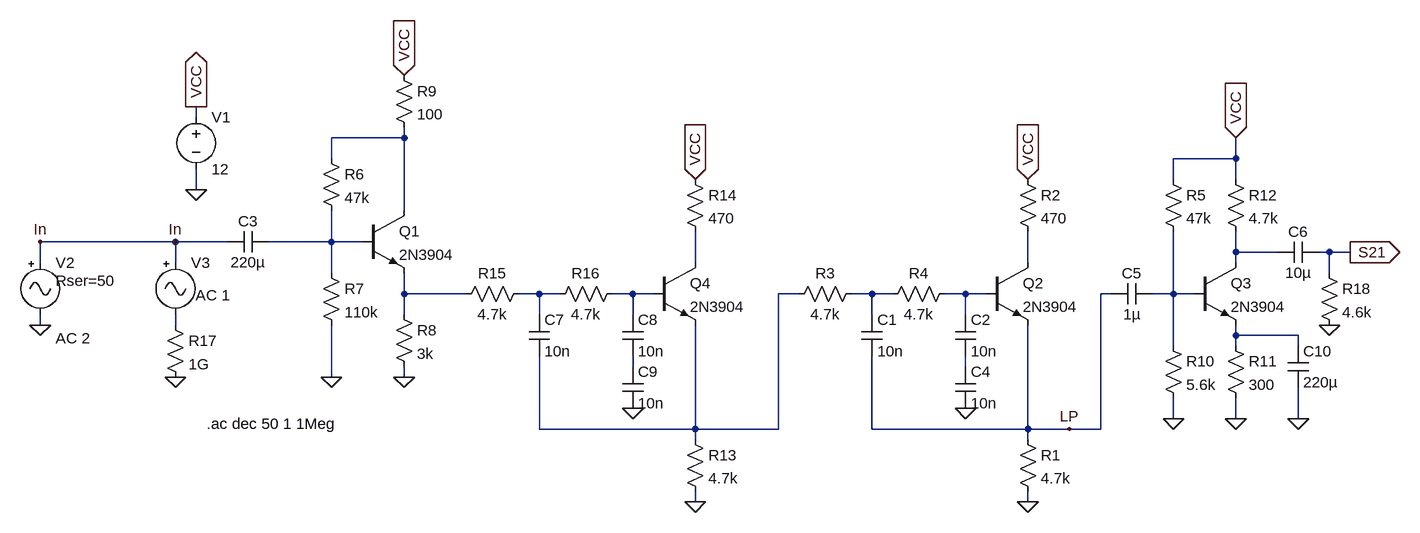
[diagram p0: schematic Active AF Filter.asc]
Active AF Filter.asc, the LTspice schematic file:
Version 4
SHEET 1 1320 724
WIRE -688 64 -688 48
WIRE -368 96 -368 80
WIRE -368 96 -480 96
WIRE -480 128 -480 96
WIRE 912 128 912 96
WIRE 912 128 816 128
WIRE 816 160 816 128
WIRE 912 160 912 128
WIRE -688 176 -688 144
WIRE -368 208 -368 96
WIRE -720 256 -928 256
WIRE -640 256 -720 256
WIRE -480 256 -480 208
WIRE -480 256 -576 256
WIRE -432 256 -480 256
WIRE 912 272 912 240
WIRE 976 272 912 272
WIRE 1056 272 1040 272
WIRE 1088 272 1056 272
WIRE -928 288 -928 256
WIRE -720 288 -720 256
WIRE 80 288 80 240
WIRE 592 288 592 240
WIRE 912 288 912 272
WIRE -480 304 -480 256
WIRE 1056 304 1056 272
WIRE -368 336 -368 304
WIRE -272 336 -368 336
WIRE -160 336 -192 336
WIRE -128 336 -160 336
WIRE -16 336 -48 336
WIRE 16 336 -16 336
WIRE 240 336 208 336
WIRE 352 336 320 336
WIRE 384 336 352 336
WIRE 496 336 464 336
WIRE 528 336 496 336
WIRE 720 336 704 336
WIRE 816 336 816 240
WIRE 816 336 784 336
WIRE 848 336 816 336
WIRE -368 368 -368 336
WIRE -160 368 -160 336
WIRE -16 368 -16 336
WIRE 352 368 352 336
WIRE 496 368 496 336
WIRE -928 384 -928 368
WIRE -720 384 -720 368
WIRE 912 400 912 384
WIRE 1008 400 912 400
WIRE 816 416 816 336
WIRE 912 416 912 400
WIRE 1008 416 1008 400
WIRE -16 448 -16 432
WIRE 496 448 496 432
WIRE -480 464 -480 384
WIRE -368 464 -368 448
WIRE 816 528 816 496
WIRE 912 528 912 496
WIRE 1008 528 1008 480
WIRE -160 544 -160 432
WIRE 80 544 80 384
WIRE 80 544 -160 544
WIRE 208 544 208 336
WIRE 208 544 80 544
WIRE 352 544 352 432
WIRE 592 544 592 384
WIRE 592 544 352 544
WIRE 656 544 592 544
WIRE 704 544 704 336
WIRE 704 544 656 544
WIRE 80 560 80 544
WIRE 592 560 592 544
WIRE 80 656 80 640
WIRE 592 656 592 640
FLAG -688 176 0
FLAG 592 656 0
FLAG -928 384 0
FLAG 496 512 0
FLAG -688 48 VCC
IOPIN -688 48 Out
FLAG -480 464 0
FLAG -368 464 0
FLAG 592 160 VCC
IOPIN 592 160 In
FLAG -368 0 VCC
IOPIN -368 0 In
FLAG -928 256 In
FLAG 816 528 0
FLAG 912 528 0
FLAG 1088 272 S21
IOPIN 1088 272 Out
FLAG 912 96 VCC
IOPIN 912 96 In
FLAG 656 544 LP
FLAG 80 656 0
FLAG -16 512 0
FLAG 80 160 VCC
IOPIN 80 160 In
FLAG 1056 384 0
FLAG 1008 528 0
FLAG -720 256 In
FLAG -720 464 0
SYMBOL npn 528 288 R0
SYMATTR InstName Q2
SYMATTR Value 2N3904
SYMBOL res 576 544 R0
SYMATTR InstName R1
SYMATTR Value 4.7k
SYMBOL res 576 144 R0
SYMATTR InstName R2
SYMATTR Value 470
SYMBOL voltage -688 48 R0
WINDOW 123 0 0 Left 0
WINDOW 39 0 0 Left 0
SYMATTR InstName V1
SYMATTR Value 12
SYMBOL Misc\\signal -928 272 R0
WINDOW 123 24 132 Left 0
WINDOW 39 24 44 Left 0
SYMATTR Value2 AC 2
SYMATTR SpiceLine Rser=50
SYMATTR InstName V2
SYMATTR Value ""
SYMBOL res 336 320 R90
WINDOW 0 0 56 VBottom 0
WINDOW 3 32 56 VTop 0
SYMATTR InstName R3
SYMATTR Value 4.7k
SYMBOL res 480 320 R90
WINDOW 0 0 56 VBottom 0
WINDOW 3 32 56 VTop 0
SYMATTR InstName R4
SYMATTR Value 4.7k
SYMBOL cap 336 368 R0
SYMATTR InstName C1
SYMATTR Value 10n
SYMBOL cap 480 368 R0
SYMATTR InstName C2
SYMATTR Value 10n
SYMBOL npn -432 208 R0
SYMATTR InstName Q1
SYMATTR Value 2N3904
SYMBOL res -496 112 R0
SYMATTR InstName R6
SYMATTR Value 47k
SYMBOL res -496 288 R0
SYMATTR InstName R7
SYMATTR Value 110k
SYMBOL res -384 352 R0
SYMATTR InstName R8
SYMATTR Value 3k
SYMBOL cap -576 240 R90
WINDOW 0 0 32 VBottom 0
WINDOW 3 32 32 VTop 0
SYMATTR InstName C3
SYMATTR Value 220µ
SYMBOL res -384 -16 R0
SYMATTR InstName R9
SYMATTR Value 100
SYMBOL cap 480 448 R0
SYMATTR InstName C4
SYMATTR Value 10n
SYMBOL npn 848 288 R0
SYMATTR InstName Q3
SYMATTR Value 2N3904
SYMBOL cap 784 320 R90
WINDOW 0 0 32 VBottom 0
WINDOW 3 32 32 VTop 0
SYMATTR InstName C5
SYMATTR Value 1µ
SYMBOL res 800 144 R0
SYMATTR InstName R5
SYMATTR Value 47k
SYMBOL res 800 400 R0
SYMATTR InstName R10
SYMATTR Value 5.6k
SYMBOL res 896 400 R0
SYMATTR InstName R11
SYMATTR Value 300
SYMBOL res 896 144 R0
SYMATTR InstName R12
SYMATTR Value 4.7k
SYMBOL cap 1040 256 R90
WINDOW 0 0 32 VBottom 0
WINDOW 3 32 32 VTop 0
SYMATTR InstName C6
SYMATTR Value 10µ
SYMBOL npn 16 288 R0
SYMATTR InstName Q4
SYMATTR Value 2N3904
SYMBOL res 64 544 R0
SYMATTR InstName R13
SYMATTR Value 4.7k
SYMBOL res 64 144 R0
SYMATTR InstName R14
SYMATTR Value 470
SYMBOL res -176 320 R90
WINDOW 0 0 56 VBottom 0
WINDOW 3 32 56 VTop 0
SYMATTR InstName R15
SYMATTR Value 4.7k
SYMBOL res -32 320 R90
WINDOW 0 0 56 VBottom 0
WINDOW 3 32 56 VTop 0
SYMATTR InstName R16
SYMATTR Value 4.7k
SYMBOL cap -176 368 R0
SYMATTR InstName C7
SYMATTR Value 10n
SYMBOL cap -32 368 R0
SYMATTR InstName C8
SYMATTR Value 10n
SYMBOL cap -32 448 R0
SYMATTR InstName C9
SYMATTR Value 10n
SYMBOL res 1040 288 R0
SYMATTR InstName R18
SYMATTR Value 4.6k
SYMBOL cap 992 416 R0
SYMATTR InstName C10
SYMATTR Value 220µ
SYMBOL Misc\\signal -720 272 R0
WINDOW 123 31 66 Left 0
WINDOW 39 24 44 Left 0
SYMATTR Value2 AC 1
SYMATTR InstName V3
SYMATTR Value ""
SYMBOL res -736 368 R0
SYMATTR InstName R17
SYMATTR Value 1G
TEXT -672 536 Left 0 !.ac dec 50 1 1Meg

The netlist it stands for:
* Active AF Filter.asc
Q2 N005 N011 LP 0 2N3904
R1 LP 0 4.7k
R2 VCC N005 470
V1 VCC 0 12
V2 In 0 AC 2 Rser=50
R3 N010 N009 4.7k
R4 N011 N010 4.7k
C1 N010 LP 10n
C2 N011 N016 10n
Q1 N001 N002 N006 0 2N3904
R6 N001 N002 47k
R7 N002 0 110k
R8 N006 0 3k
C3 N002 In 220µ
R9 VCC N001 100
C4 N016 0 10n
Q3 N003 N012 N014 0 2N3904
C5 N012 LP 1µ
R5 VCC N012 47k
R10 N012 0 5.6k
R11 N014 0 300
R12 VCC N003 4.7k
C6 S21 N003 10µ
Q4 N004 N008 N009 0 2N3904
R13 N009 0 4.7k
R14 VCC N004 470
R15 N007 N006 4.7k
R16 N008 N007 4.7k
C7 N007 N009 10n
C8 N008 N015 10n
C9 N015 0 10n
R18 S21 0 4.6k
C10 N014 0 220µ
V3 In N013 AC 1
R17 N013 0 1G
.model NPN NPN
.model PNP PNP
.lib standard.bjt
.ac dec 50 1 1Meg
.backanno
.end